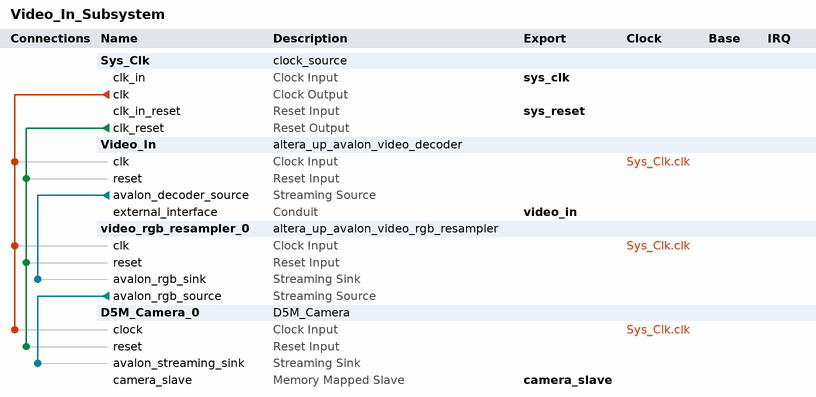
[diagram p0: system contents]
# Platform Designer (Qsys) system Video_In_Subsystem, Cyclone IV E EP4CE115F29C7
# Parameters at their usual value, and those the tool derives, are not listed.
package require -exact qsys 16.1
create_system Video_In_Subsystem
set_project_property DEVICE_FAMILY {Cyclone IV E}
set_project_property DEVICE EP4CE115F29C7

add_instance Sys_Clk clock_source 16.1
set_instance_parameter_value Sys_Clk clockFrequency 50000000
set_instance_parameter_value Sys_Clk clockFrequencyKnown false

add_instance Video_In altera_up_avalon_video_decoder 16.1
set_instance_parameter_value Video_In video_source {5MP Daughtercard (THDB_D5M)}

add_instance video_rgb_resampler_0 altera_up_avalon_video_rgb_resampler 16.1
set_instance_parameter_value video_rgb_resampler_0 alpha 1023
set_instance_parameter_value video_rgb_resampler_0 input_type {8-bit RGB}
set_instance_parameter_value video_rgb_resampler_0 output_type {24-bit RGB}

add_instance D5M_Camera_0 D5M_Camera 1.0

# connections
add_connection Sys_Clk.clk D5M_Camera_0.clock clock
add_connection Sys_Clk.clk Video_In.clk clock
add_connection Sys_Clk.clk video_rgb_resampler_0.clk clock
add_connection Sys_Clk.clk_reset D5M_Camera_0.reset reset
add_connection Sys_Clk.clk_reset Video_In.reset reset
add_connection Sys_Clk.clk_reset video_rgb_resampler_0.reset reset
add_connection Video_In.avalon_decoder_source video_rgb_resampler_0.avalon_rgb_sink avalon_streaming
add_connection video_rgb_resampler_0.avalon_rgb_source D5M_Camera_0.avalon_streaming_sink avalon_streaming

# exported interfaces
add_interface camera_slave avalon slave
set_interface_property camera_slave EXPORT_OF D5M_Camera_0.camera_slave
add_interface sys_clk clock sink
set_interface_property sys_clk EXPORT_OF Sys_Clk.clk_in
add_interface sys_reset reset sink
set_interface_property sys_reset EXPORT_OF Sys_Clk.clk_in_reset
add_interface video_in conduit end
set_interface_property video_in EXPORT_OF Video_In.external_interface

set_interconnect_requirement {$system} qsys_mm.clockCrossingAdapter HANDSHAKE
set_interconnect_requirement {$system} qsys_mm.enableEccProtection FALSE
set_interconnect_requirement {$system} qsys_mm.insertDefaultSlave FALSE
set_interconnect_requirement {$system} qsys_mm.maxAdditionalLatency 1

save_system Video_In_Subsystem.qsys
